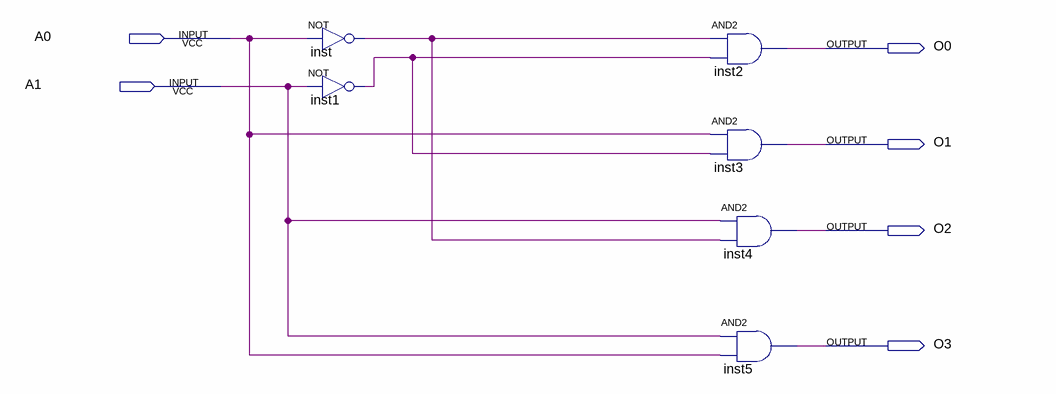
[diagram p0: schematic sheet]
// Quartus schematic Four_one_DEMUX.bdf as structural Verilog: 6 symbols, 6 pins
module Four_one_DEMUX (
  input  A0,
  input  A1,
  output O0,
  output O1,
  output O2,
  output O3
);

  wire inst1_out, inst_out;

  not inst (inst_out, A0);
  not inst1 (inst1_out, A1);
  and inst2 (O0, inst_out, inst1_out);
  and inst3 (O1, A0, inst1_out);
  and inst4 (O2, A1, inst_out);
  and inst5 (O3, A1, A0);
endmodule
